# EAGLE design PPaddle (EAGLE 6.6.0)
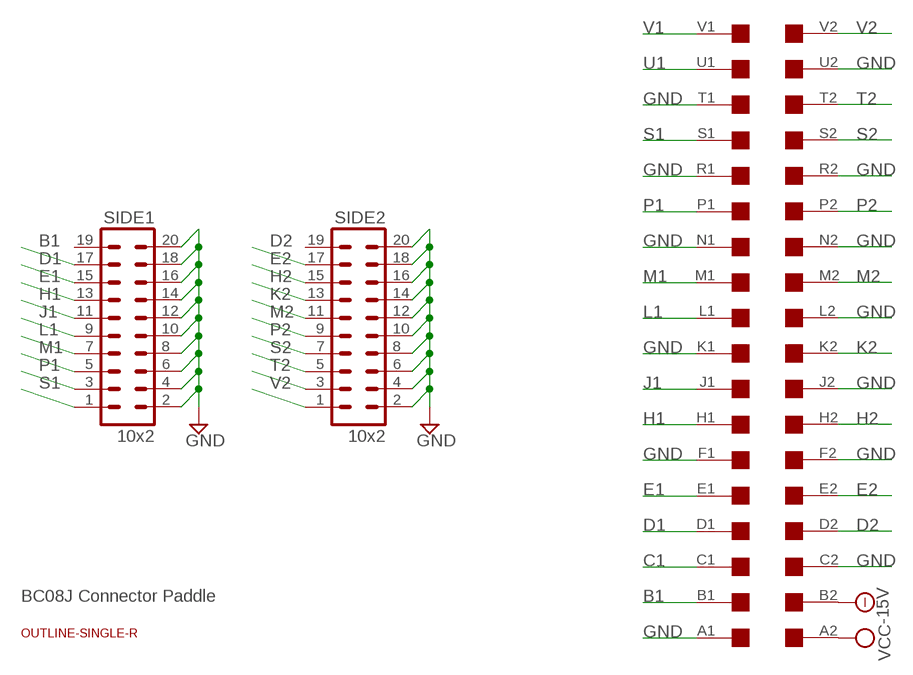
[diagram p0: schematic, sheet 1]

## Parts
SIDE1  10x2  20H  [20H]
SIDE2  10x2  20H  [20H]
U$1  OUTLINE-SINGLE-R  [SINGLE-R]
U$2  EDGE  SINGLE  [EDGE-CON2]

## Nets
-15V: U$2.B2
B1: SIDE1.17 U$2.B1
C1: U$2.C1
D1: SIDE1.15 U$2.D1
D2: SIDE2.17 U$2.D2
E1: SIDE1.13 U$2.E1
E2: SIDE2.15 U$2.E2
GND [Ground]: SIDE1.2 SIDE1.4 SIDE1.6 SIDE1.8 SIDE1.10 SIDE1.12 SIDE1.14 SIDE1.16 SIDE1.18 SIDE1.20 SIDE2.2 SIDE2.4 SIDE2.6 SIDE2.8 SIDE2.10 SIDE2.12 SIDE2.14 SIDE2.16 SIDE2.18 SIDE2.20 U$2.A1 U$2.C2 U$2.F1 U$2.F2 U$2.J2 U$2.K1 U$2.L2 U$2.N1 U$2.N2 U$2.R1 U$2.R2 U$2.T1 U$2.U2
H1: SIDE1.11 U$2.H1
H2: SIDE2.13 U$2.H2
J1: SIDE1.9 U$2.J1
K2: SIDE2.11 U$2.K2
L1: SIDE1.7 U$2.L1
M1: SIDE1.5 U$2.M1
M2: SIDE2.9 U$2.M2
P1: SIDE1.3 U$2.P1
P2: SIDE2.7 U$2.P2
S1: SIDE1.1 U$2.S1
S2: SIDE2.5 U$2.S2
T2: SIDE2.3 U$2.T2
U1: U$2.U1
V1: U$2.V1
V2: SIDE2.1 U$2.V2
VCC: U$2.A2
Unconnected: SIDE1.19 SIDE2.19

## Notes on the sheet
- BC08J Connector Paddle

## Library data of the parts
SIDE1 SIDE2 = con-harting-h:20H: CONNECTOR; OC_FARNELL: unknown; OC_NEWARK: unknown
U$1 = dec-con:OUTLINE-*: Board outlines for DEC boards.
U$2 = dec-con:SINGLE: Single-Height DEC board

## Board
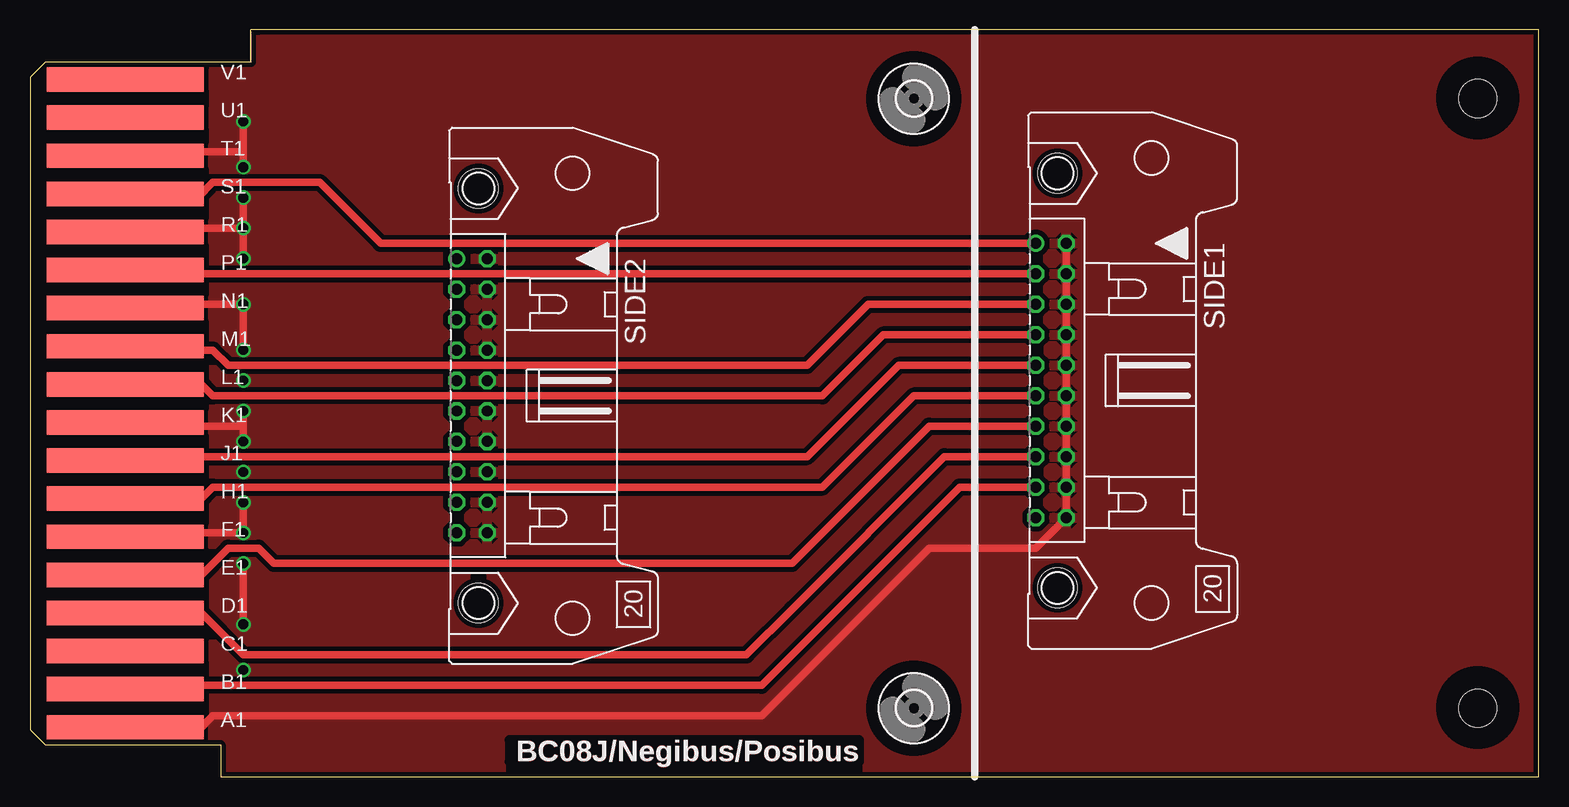
[diagram p1: board, top side]
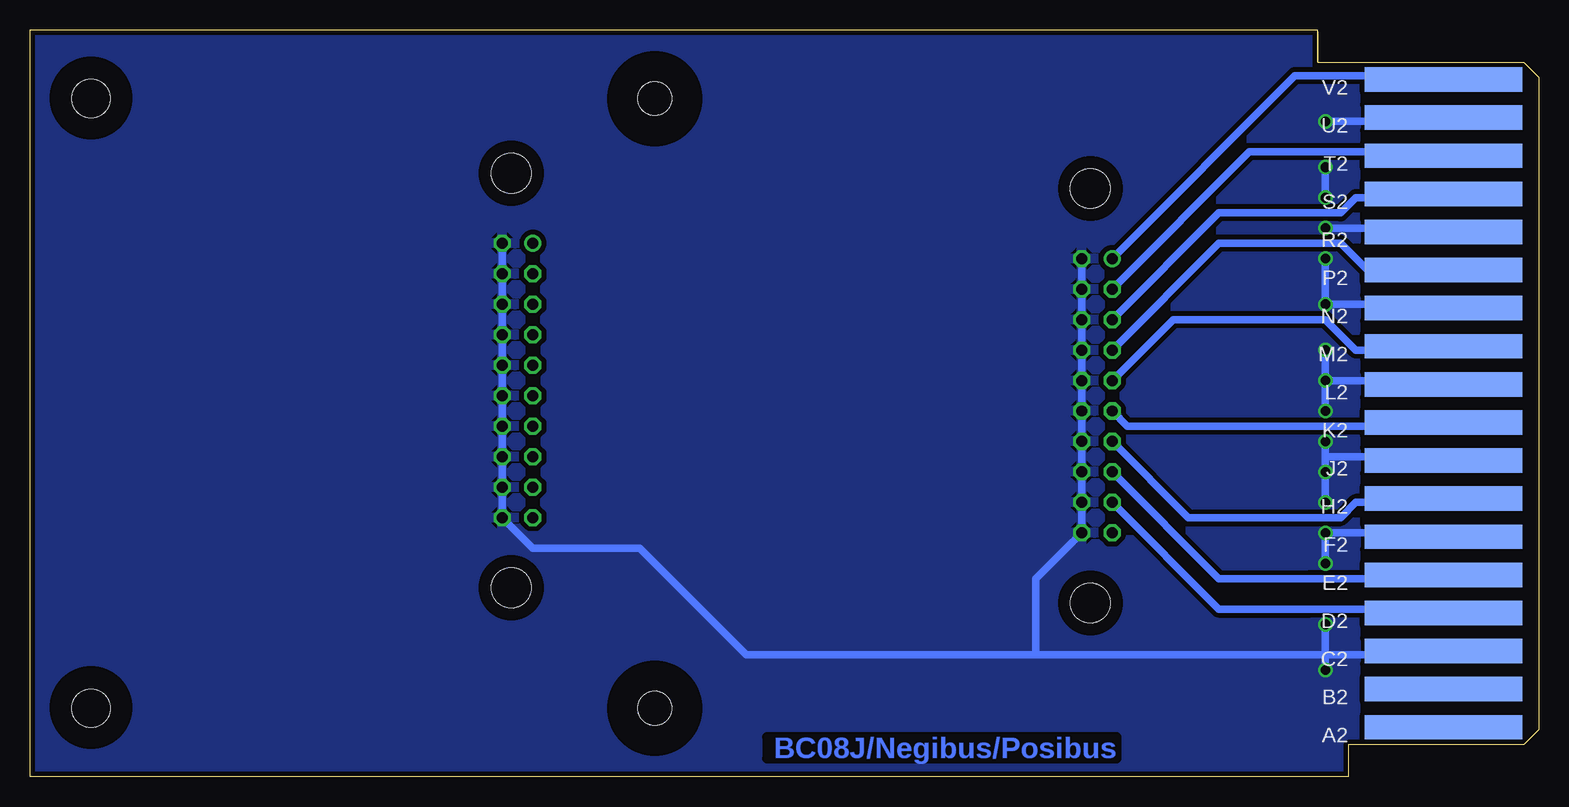
[diagram p2: board, bottom side, seen from below]

Size 125.73 x 62.23 mm. Coordinates in mm from the lower left corner, seen from the top.
Copper layers (1+16): Top 0.035mm / dielectric 1.5mm / Bottom 0.035mm
Design rules "16mils": minimum track width 16mil, minimum drill 32mil, track to track 15mil, track to pad 10mil, pad to pad 10mil, via to via 10mil, smd to smd 10mil, copper to edge 13mil, drill to drill 10mil, minimum pad ring 10mil, minimum via ring 8mil, stop-mask expansion 0mil, vias tented up to drill 0mil, thermal gap 10mil
tRestrict: area 117.8,53.7 to 123.5,59.4; area 117.8,2.9 to 123.5,8.6
bRestrict: area 117.8,53.7 to 123.5,59.4; area 117.8,2.9 to 123.5,8.6; area 117.8,53.7 to 123.5,59.4

### Footprints (pad centres in the part's own frame; a part is rotated, then mirrored left to right if it is on the bottom)
20H = drill 0.914: 1 -11.43,-1.27 | drill 0.914 octagon: 2 -11.43,1.27; 3 -8.89,-1.27; 4 -8.89,1.27; 5 -6.35,-1.27; 6 -6.35,1.27; 7 -3.81,-1.27; 8 -3.81,1.27; 9 -1.27,-1.27; 10 -1.27,1.27; 11 1.27,-1.27; 12 1.27,1.27; 13 3.81,-1.27; 14 3.81,1.27; 15 6.35,-1.27; 16 6.35,1.27; 17 8.89,-1.27; 18 8.89,1.27; 19 11.43,-1.27; 20 11.43,1.27 | hole 3.302: -17.272,0.533; 17.272,0.533
SINGLE-R = hole 3.175: 5.08,5.715; 5.08,56.515
EDGE-CON2 = smd 13.106 x 2.032: A1 7.938,4.128; B1 7.938,7.303; C1 7.938,10.477; D1 7.938,13.652; E1 7.938,16.828; F1 7.938,20.003; H1 7.938,23.177; J1 7.938,26.352; K1 7.938,29.527; L1 7.938,32.703; M1 7.938,35.877; N1 7.938,39.053; P1 7.938,42.227; R1 7.938,45.403; S1 7.938,48.578; T1 7.938,51.752; U1 7.938,54.928; V1 7.938,58.102 | smd 13.106 x 2.032 bottom: A2 7.938,4.128; B2 7.938,7.303; C2 7.938,10.477; D2 7.938,13.652; E2 7.938,16.828; F2 7.938,20.003; H2 7.938,23.177; J2 7.938,26.352; K2 7.938,29.527; L2 7.938,32.703; M2 7.938,35.877; N2 7.938,39.053; P2 7.938,42.227; R2 7.938,45.403; S2 7.938,48.578; T2 7.938,51.752; U2 7.938,54.928; V2 7.938,58.102
2,8 = hole 2.8: 0,0

### Placement (x,y rotation side)
SIDE1  85.09,33.02 270 top
SIDE2  36.83,31.75 270 top
U$1  125.73,62.23 180 top
U$2  0,0 0 top
U$3  [2,8]  73.66,56.52 180 top
U$4  [2,8]  73.66,5.71 180 top

### Tracks (layer width: path | path; a pad name or v marks a point on that pad's centre or on a via)
B1
  Top 0.61: SIDE1.17 77.47,24.13 60.96,7.62 8.26,7.62 U$2.B1
D1
  Top 0.61: U$2.D1 8.26,13.97 13.97,13.97 17.78,10.16 20.32,10.16 53.34,10.16 59.69,10.16 63.5,13.97 76.2,26.67 SIDE1.15
D2
  Bottom 0.61: SIDE2.17 26.67,13.97 19.05,13.97 10.16,13.97 9.84,13.65 U$2.D2
E1
  Top 0.61: U$2.E1 8.26,16.51 13.97,16.51 16.51,19.05 19.05,19.05 20.32,17.78 63.5,17.78 74.93,29.21 SIDE1.13
E2
  Bottom 0.61: SIDE2.15 26.67,16.51 19.05,16.51 10.16,16.51 9.84,16.83 U$2.E2
GND  (via drill 0.81)
  Top 0.61: 10.16,52.07 9.84,51.75 U$2.T1 8.26,52.07 17.78,52.07 | SIDE1.2 SIDE1.20 83.82,19.05 74.93,19.05 60.96,5.08 15.24,5.08 13.97,3.81 8.26,3.81 U$2.A1 | U$2.R2 8.26,45.72 v17.78,45.72 | U$2.N2 8.26,39.37 v17.78,39.37 v17.78,35.56 | U$2.F2 8.26,20.32 v17.78,20.32 v17.78,22.86 | v17.78,30.48 17.78,29.21 | 17.78,29.21 v17.78,27.94 | U$2.K1 8.26,29.21 17.78,29.21 | v17.78,17.78 v17.78,12.7 | v17.78,43.18 v17.78,45.72 | 17.78,52.07 v17.78,54.61 | v17.78,45.72 v17.78,48.26 | v17.78,50.8 17.78,52.07
  Bottom 0.61: U$2.C2 9.84,10.48 10.16,10.16 17.78,10.16 | 17.78,10.16 41.91,10.16 | SIDE1.20 SIDE1.2 SIDE1.4 SIDE1.6 SIDE1.8 SIDE1.10 SIDE1.12 SIDE1.14 SIDE1.16 SIDE1.18 SIDE1.20 | SIDE1.20 83.82,19.05 74.93,19.05 66.04,10.16 41.91,10.16 | 41.91,10.16 41.91,16.51 SIDE2.20 SIDE2.18 SIDE2.16 SIDE2.14 SIDE2.12 SIDE2.10 SIDE2.8 SIDE2.6 SIDE2.4 SIDE2.2 | U$2.U2 8.26,54.61 v17.78,54.61 | U$2.R2 8.26,45.72 v17.78,45.72 | U$2.N2 8.26,39.37 v17.78,39.37 v17.78,43.18 | U$2.F2 8.26,20.32 v17.78,20.32 v17.78,17.78 | U$2.L2 8.26,33.02 v17.78,33.02 | v17.78,33.02 v17.78,30.48 | v17.78,27.94 17.78,26.67 | U$2.J2 8.26,26.67 17.78,26.67 | v17.78,33.02 v17.78,35.56 | v17.78,12.7 17.78,10.16 | v17.78,22.86 17.78,26.67 | v17.78,48.26 v17.78,50.8 | v17.78,8.89 17.78,10.16
  other vias: 17.78,25.4
  pour Bottom (isolate 0.406): 125.73,62.23 15.24,62.23 15.24,0 125.73,0
  pour Top (isolate 0.406): 125.73,62.23 15.24,62.23 15.24,0 125.73,0
H1
  Top 0.61: U$2.H1 8.26,22.86 13.97,22.86 15.24,24.13 66.04,24.13 73.66,31.75 SIDE1.11
H2
  Bottom 0.61: SIDE2.13 29.21,21.59 16.51,21.59 15.24,22.86 8.89,22.86 8.57,23.18 U$2.H2
J1
  Top 0.61: U$2.J1 8.26,26.67 64.77,26.67 72.39,34.29 SIDE1.9
K2
  Bottom 0.61: SIDE2.11 34.29,29.21 8.89,29.21 8.57,29.53 U$2.K2
L1
  Top 0.61: SIDE1.7 71.12,36.83 66.04,31.75 15.24,31.75 13.97,33.02 8.89,33.02 8.57,32.7 U$2.L1
M1
  Top 0.61: U$2.M1 8.57,35.88 8.89,35.56 15.24,35.56 16.51,34.29 64.77,34.29 69.85,39.37 SIDE1.5
M2
  Bottom 0.61: SIDE2.9 30.48,38.1 17.78,38.1 15.24,35.56 7.62,35.56 U$2.M2
P1
  Top 0.61: U$2.P1 8.57,42.23 8.89,41.91 SIDE1.3
P2
  Bottom 0.61: SIDE2.7 26.67,44.45 16.51,44.45 13.97,41.91 10.16,41.91 9.84,42.23 U$2.P2
S1
  Top 0.61: U$2.S1 9.84,48.58 10.16,48.26 13.97,48.26 15.24,49.53 24.13,49.53 29.21,44.45 SIDE1.1
S2
  Bottom 0.61: SIDE2.5 26.67,46.99 16.51,46.99 15.24,48.26 10.16,48.26 9.84,48.58 U$2.S2
T2
  Bottom 0.61: U$2.T2 8.89,52.07 24.13,52.07 SIDE2.3
V2
  Bottom 0.61: U$2.V2 8.57,58.1 8.89,58.42 20.32,58.42 SIDE2.1

### Text on the board
Top: BC08J/Negibus/Posibus
Bottom: BC08J/Negibus/Posibus
tPlace: BC08J/Negibus/Posibus
tValues: Side 1 | Side 2 | BC08J